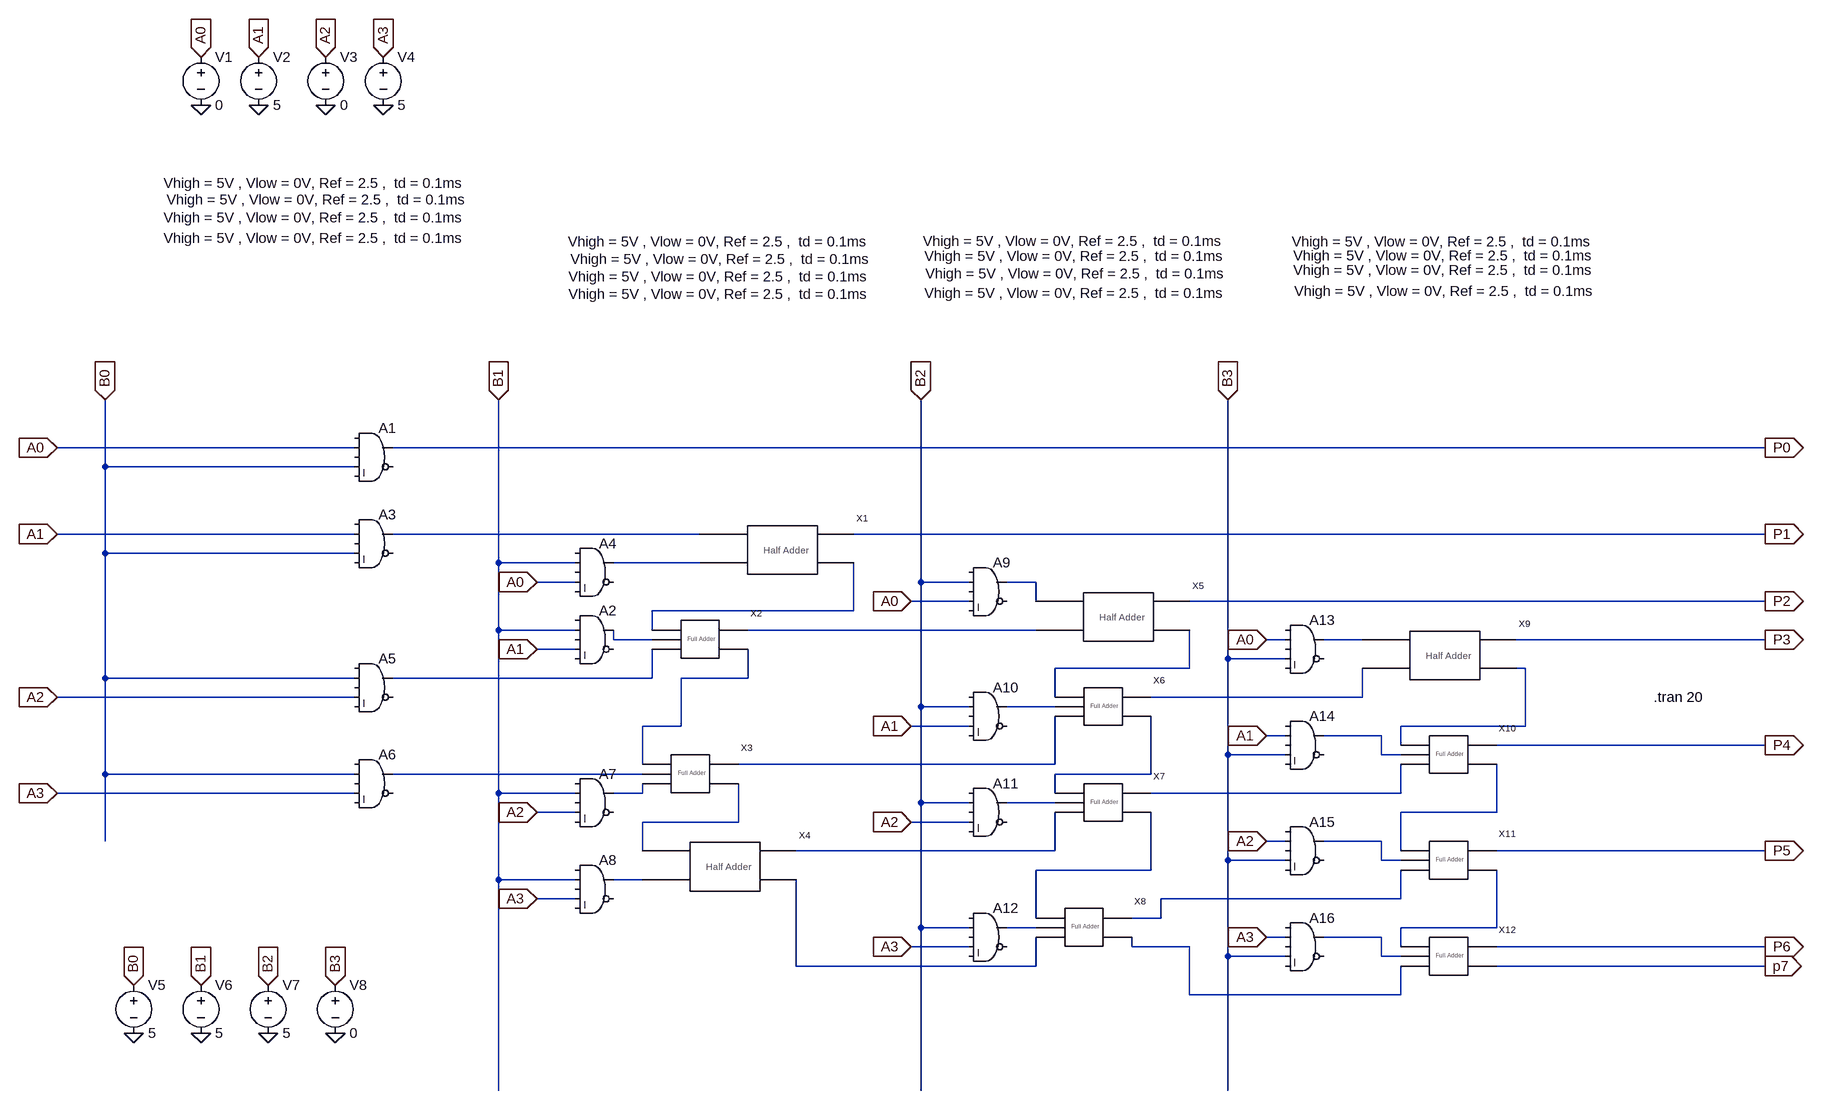
[diagram p0: schematic 4_multiplier.asc]
4_multiplier.asc, the LTspice schematic file:
Version 4
SHEET 1 3064 760
WIRE 224 -736 -272 -736
WIRE 2976 -736 288 -736
WIRE -192 -704 -192 -816
WIRE 224 -704 -192 -704
WIRE 224 -592 -272 -592
WIRE 800 -592 288 -592
WIRE 2976 -592 1056 -592
WIRE -192 -560 -192 -704
WIRE 224 -560 -192 -560
WIRE 464 -544 464 -816
WIRE 592 -544 464 -544
WIRE 800 -544 656 -544
WIRE 592 -512 528 -512
WIRE 1168 -512 1168 -816
WIRE 1248 -512 1168 -512
WIRE 1360 -512 1312 -512
WIRE 1248 -480 1152 -480
WIRE 1360 -480 1360 -512
WIRE 2976 -480 1616 -480
WIRE 1056 -464 1056 -544
WIRE 1056 -464 720 -464
WIRE 464 -432 464 -544
WIRE 592 -432 464 -432
WIRE 720 -432 720 -464
WIRE 1360 -432 880 -432
WIRE 656 -416 656 -432
WIRE 720 -416 656 -416
WIRE 1776 -416 1744 -416
WIRE 1904 -416 1840 -416
WIRE 2976 -416 2160 -416
WIRE 592 -400 528 -400
WIRE 1680 -384 1680 -816
WIRE 1776 -384 1680 -384
WIRE 1616 -368 1616 -432
WIRE 1616 -368 1392 -368
WIRE 2176 -368 2160 -368
WIRE -192 -352 -192 -560
WIRE 224 -352 -192 -352
WIRE 720 -352 720 -400
WIRE 720 -352 288 -352
WIRE 880 -352 880 -400
WIRE 880 -352 768 -352
WIRE 224 -320 -272 -320
WIRE 1392 -320 1392 -368
WIRE 1904 -320 1904 -368
WIRE 1904 -320 1552 -320
WIRE 1168 -304 1168 -512
WIRE 1248 -304 1168 -304
WIRE 1392 -304 1312 -304
WIRE 768 -272 768 -352
WIRE 768 -272 704 -272
WIRE 1248 -272 1152 -272
WIRE 2176 -272 2176 -368
WIRE 2176 -272 1968 -272
WIRE 1776 -256 1744 -256
WIRE 1936 -256 1840 -256
WIRE 1968 -240 1968 -272
WIRE 2976 -240 2128 -240
WIRE 1680 -224 1680 -384
WIRE 1776 -224 1680 -224
WIRE 1936 -224 1936 -256
WIRE 1968 -224 1936 -224
WIRE 704 -208 704 -272
WIRE 1392 -208 1392 -288
WIRE 1392 -208 864 -208
WIRE -192 -192 -192 -352
WIRE 224 -192 -192 -192
WIRE 704 -192 288 -192
WIRE 1552 -192 1552 -288
WIRE 1552 -192 1392 -192
WIRE 224 -160 -272 -160
WIRE 464 -160 464 -432
WIRE 592 -160 464 -160
WIRE 704 -160 704 -176
WIRE 704 -160 656 -160
WIRE 1392 -160 1392 -192
WIRE 1968 -160 1968 -208
WIRE 1968 -160 1552 -160
WIRE 1168 -144 1168 -304
WIRE 1248 -144 1168 -144
WIRE 1392 -144 1312 -144
WIRE 592 -128 528 -128
WIRE 2128 -128 2128 -208
WIRE 2128 -128 1968 -128
WIRE 864 -112 864 -176
WIRE 864 -112 704 -112
WIRE 1248 -112 1152 -112
WIRE -192 -80 -192 -192
WIRE 1776 -80 1744 -80
WIRE 1936 -80 1840 -80
WIRE 704 -64 704 -112
WIRE 1392 -64 1392 -128
WIRE 1392 -64 960 -64
WIRE 1968 -64 1968 -128
WIRE 2976 -64 2128 -64
WIRE 1680 -48 1680 -224
WIRE 1776 -48 1680 -48
WIRE 1936 -48 1936 -80
WIRE 1968 -48 1936 -48
WIRE 1552 -32 1552 -128
WIRE 1552 -32 1360 -32
WIRE 464 -16 464 -160
WIRE 592 -16 464 -16
WIRE 704 -16 656 -16
WIRE 592 16 528 16
WIRE 1968 16 1968 -32
WIRE 1968 16 1568 16
WIRE 1360 48 1360 -32
WIRE 1568 48 1568 16
WIRE 1568 48 1520 48
WIRE 1168 64 1168 -144
WIRE 1248 64 1168 64
WIRE 1360 64 1312 64
WIRE 2128 64 2128 -32
WIRE 2128 64 1968 64
WIRE 1776 80 1744 80
WIRE 1936 80 1840 80
WIRE 1248 96 1152 96
WIRE 1520 96 1520 80
WIRE 1616 96 1520 96
WIRE 1968 96 1968 64
WIRE 2976 96 2128 96
WIRE 1680 112 1680 -48
WIRE 1776 112 1680 112
WIRE 1936 112 1936 80
WIRE 1968 112 1936 112
WIRE 960 128 960 -16
WIRE 1360 128 1360 80
WIRE 1360 128 960 128
WIRE 2976 128 2128 128
WIRE 1616 176 1616 96
WIRE 1968 176 1968 128
WIRE 1968 176 1616 176
WIRE 464 336 464 -16
WIRE 1168 336 1168 64
WIRE 1680 336 1680 112
FLAG -272 -736 A0
IOPIN -272 -736 In
FLAG -272 -592 A1
IOPIN -272 -592 In
FLAG 1152 -480 A0
IOPIN 1152 -480 In
FLAG -272 -160 A3
IOPIN -272 -160 In
FLAG 528 -512 A0
IOPIN 528 -512 In
FLAG 528 -400 A1
IOPIN 528 -400 In
FLAG -272 -320 A2
IOPIN -272 -320 In
FLAG 528 -128 A2
IOPIN 528 -128 In
FLAG 528 16 A3
IOPIN 528 16 In
FLAG 1152 -272 A1
IOPIN 1152 -272 In
FLAG 1152 -112 A2
IOPIN 1152 -112 In
FLAG 1152 96 A3
IOPIN 1152 96 In
FLAG 1744 -416 A0
IOPIN 1744 -416 In
FLAG 1744 -256 A1
IOPIN 1744 -256 In
FLAG 1744 -80 A2
IOPIN 1744 -80 In
FLAG 1744 80 A3
IOPIN 1744 80 In
FLAG -192 -816 B0
IOPIN -192 -816 In
FLAG 464 -816 B1
IOPIN 464 -816 In
FLAG 1168 -816 B2
IOPIN 1168 -816 In
FLAG 2976 -736 P0
IOPIN 2976 -736 Out
FLAG 2976 -592 P1
IOPIN 2976 -592 Out
FLAG 2976 -480 P2
IOPIN 2976 -480 Out
FLAG 2976 -416 P3
IOPIN 2976 -416 Out
FLAG 2976 -240 P4
IOPIN 2976 -240 Out
FLAG 2976 -64 P5
IOPIN 2976 -64 Out
FLAG 2976 96 P6
IOPIN 2976 96 Out
FLAG 1680 -816 B3
IOPIN 1680 -816 In
FLAG -32 -1312 0
FLAG 64 -1312 0
FLAG 176 -1312 0
FLAG 272 -1312 0
FLAG -32 -1392 A0
IOPIN -32 -1392 In
FLAG 64 -1392 A1
IOPIN 64 -1392 In
FLAG 176 -1392 A2
IOPIN 176 -1392 In
FLAG 272 -1392 A3
IOPIN 272 -1392 In
FLAG -144 240 0
FLAG -32 240 0
FLAG 80 240 0
FLAG 192 240 0
FLAG -144 160 B0
IOPIN -144 160 In
FLAG -32 160 B1
IOPIN -32 160 In
FLAG 80 160 B2
IOPIN 80 160 In
FLAG 192 160 B3
IOPIN 192 160 In
FLAG 2976 128 p7
IOPIN 2976 128 Out
SYMBOL Digital\\and 256 -784 R0
WINDOW 3 -350 -335 Left 2
SYMATTR InstName A1
SYMATTR Value Vhigh = 5V , Vlow = 0V, Ref = 2.5 ,  td = 0.1ms
SYMBOL Digital\\and 624 -480 R0
WINDOW 3 -40 -570 Left 2
SYMATTR InstName A2
SYMATTR Value Vhigh = 5V , Vlow = 0V, Ref = 2.5 ,  td = 0.1ms
SYMBOL Digital\\and 256 -640 R0
WINDOW 3 -350 -445 Left 2
SYMATTR InstName A3
SYMATTR Value Vhigh = 5V , Vlow = 0V, Ref = 2.5 ,  td = 0.1ms
SYMBOL Digital\\and 624 -592 R0
WINDOW 3 -44 -487 Left 2
SYMATTR InstName A4
SYMATTR Value Vhigh = 5V , Vlow = 0V, Ref = 2.5 ,  td = 0.1ms
SYMBOL half_adder 944 -560 R0
SYMATTR InstName X1
SYMBOL full_adder 800 -416 R0
SYMATTR InstName X2
SYMBOL Digital\\and 256 -400 R0
WINDOW 3 -345 -749 Left 2
SYMATTR InstName A5
SYMATTR Value Vhigh = 5V , Vlow = 0V, Ref = 2.5 ,  td = 0.1ms
SYMBOL Digital\\and 256 -240 R0
WINDOW 3 -350 -937 Left 2
SYMATTR InstName A6
SYMATTR Value Vhigh = 5V , Vlow = 0V, Ref = 2.5 ,  td = 0.1ms
SYMBOL full_adder 784 -192 R0
SYMATTR InstName X3
SYMBOL Digital\\and 624 -208 R0
WINDOW 3 -43 -813 Left 2
SYMATTR InstName A7
SYMATTR Value Vhigh = 5V , Vlow = 0V, Ref = 2.5 ,  td = 0.1ms
SYMBOL Digital\\and 624 -64 R0
WINDOW 3 -43 -928 Left 2
SYMATTR InstName A8
SYMATTR Value Vhigh = 5V , Vlow = 0V, Ref = 2.5 ,  td = 0.1ms
SYMBOL half_adder 848 -32 R0
SYMATTR InstName X4
SYMBOL Digital\\and 1280 -560 R0
WINDOW 3 -106 -433 Left 2
SYMATTR InstName A9
SYMATTR Value Vhigh = 5V , Vlow = 0V, Ref = 2.5 ,  td = 0.1ms
SYMBOL half_adder 1504 -448 R0
SYMATTR InstName X5
SYMBOL Digital\\and 1280 -352 R0
WINDOW 3 -104 -674 Left 2
SYMATTR InstName A10
SYMATTR Value Vhigh = 5V , Vlow = 0V, Ref = 2.5 ,  td = 0.1ms
SYMBOL full_adder 1472 -304 R0
SYMATTR InstName X6
SYMBOL Digital\\and 1280 -192 R0
WINDOW 3 -106 -863 Left 2
SYMATTR InstName A11
SYMATTR Value Vhigh = 5V , Vlow = 0V, Ref = 2.5 ,  td = 0.1ms
SYMBOL full_adder 1472 -144 R0
SYMATTR InstName X7
SYMBOL Digital\\and 1280 16 R0
WINDOW 3 -108 -1096 Left 2
SYMATTR InstName A12
SYMATTR Value Vhigh = 5V , Vlow = 0V, Ref = 2.5 ,  td = 0.1ms
SYMBOL Digital\\and 1808 -464 R0
WINDOW 3 -17 -533 Left 2
SYMATTR InstName A13
SYMATTR Value Vhigh = 5V , Vlow = 0V, Ref = 2.5 ,  td = 0.1ms
SYMBOL half_adder 2048 -384 R0
SYMATTR InstName X9
SYMBOL Digital\\and 1808 -304 R0
WINDOW 3 -19 -728 Left 2
SYMATTR InstName A14
SYMATTR Value Vhigh = 5V , Vlow = 0V, Ref = 2.5 ,  td = 0.1ms
SYMBOL full_adder 2048 -224 R0
SYMATTR InstName X10
SYMBOL Digital\\and 1808 -128 R0
WINDOW 3 -19 -928 Left 2
SYMATTR InstName A15
SYMATTR Value Vhigh = 5V , Vlow = 0V, Ref = 2.5 ,  td = 0.1ms
SYMBOL full_adder 2048 -48 R0
SYMATTR InstName X11
SYMBOL Digital\\and 1808 32 R0
WINDOW 3 -21 -1111 Left 2
SYMATTR InstName A16
SYMATTR Value Vhigh = 5V , Vlow = 0V, Ref = 2.5 ,  td = 0.1ms
SYMBOL full_adder 2048 112 R0
SYMATTR InstName X12
SYMBOL full_adder 1440 64 R0
SYMATTR InstName X8
SYMBOL voltage -32 -1408 R0
WINDOW 123 0 0 Left 0
WINDOW 39 0 0 Left 0
SYMATTR InstName V1
SYMATTR Value 0
SYMBOL voltage 64 -1408 R0
WINDOW 123 0 0 Left 0
WINDOW 39 0 0 Left 0
SYMATTR InstName V2
SYMATTR Value 5
SYMBOL voltage 176 -1408 R0
WINDOW 123 0 0 Left 0
WINDOW 39 0 0 Left 0
SYMATTR InstName V3
SYMATTR Value 0
SYMBOL voltage 272 -1408 R0
WINDOW 123 0 0 Left 0
WINDOW 39 0 0 Left 0
SYMATTR InstName V4
SYMATTR Value 5
SYMBOL voltage -144 144 R0
WINDOW 123 0 0 Left 0
WINDOW 39 0 0 Left 0
SYMATTR InstName V5
SYMATTR Value 5
SYMBOL voltage -32 144 R0
WINDOW 123 0 0 Left 0
WINDOW 39 0 0 Left 0
SYMATTR InstName V6
SYMATTR Value 5
SYMBOL voltage 80 144 R0
WINDOW 123 0 0 Left 0
WINDOW 39 0 0 Left 0
SYMATTR InstName V7
SYMATTR Value 5
SYMBOL voltage 192 144 R0
WINDOW 123 0 0 Left 0
WINDOW 39 0 0 Left 0
SYMATTR InstName V8
SYMATTR Value 0
TEXT 2768 -320 Left 2 !.tran 20

The netlist it stands for:
* 4_multiplier.asc
A1 0 A0 0 B0 0 0 P0 0 AND Vhigh = 5V , Vlow = 0V, Ref = 2.5 ,  td = 0.1ms
A2 0 B1 0 A1 0 0 N006 0 AND Vhigh = 5V , Vlow = 0V, Ref = 2.5 ,  td = 0.1ms
A3 0 A1 0 B0 0 0 N001 0 AND Vhigh = 5V , Vlow = 0V, Ref = 2.5 ,  td = 0.1ms
A4 0 B1 0 A0 0 0 N002 0 AND Vhigh = 5V , Vlow = 0V, Ref = 2.5 ,  td = 0.1ms
XX1 N001 N002 P1 N004 half_adder  ; pins A B Sum carry
XX2 N004 N006 N010 N011 N005 full_adder  ; pins A B Cin Cout Sum
A5 0 B0 0 A2 0 0 N010 0 AND Vhigh = 5V , Vlow = 0V, Ref = 2.5 ,  td = 0.1ms
A6 0 B0 0 A3 0 0 N016 0 AND Vhigh = 5V , Vlow = 0V, Ref = 2.5 ,  td = 0.1ms
XX3 N011 N016 N018 N022 N015 full_adder  ; pins A B Cin Cout Sum
A7 0 B1 0 A2 0 0 N018 0 AND Vhigh = 5V , Vlow = 0V, Ref = 2.5 ,  td = 0.1ms
A8 0 B1 0 A3 0 0 N026 0 AND Vhigh = 5V , Vlow = 0V, Ref = 2.5 ,  td = 0.1ms
XX4 N022 N026 N024 N032 half_adder  ; pins A B Sum carry
A9 0 B2 0 A0 0 0 N003 0 AND Vhigh = 5V , Vlow = 0V, Ref = 2.5 ,  td = 0.1ms
XX5 N003 N005 P2 N008 half_adder  ; pins A B Sum carry
A10 0 B2 0 A1 0 0 N013 0 AND Vhigh = 5V , Vlow = 0V, Ref = 2.5 ,  td = 0.1ms
XX6 N008 N013 N015 N017 N012 full_adder  ; pins A B Cin Cout Sum
A11 0 B2 0 A2 0 0 N020 0 AND Vhigh = 5V , Vlow = 0V, Ref = 2.5 ,  td = 0.1ms
XX7 N017 N020 N024 N025 N019 full_adder  ; pins A B Cin Cout Sum
A12 0 B2 0 A3 0 0 N028 0 AND Vhigh = 5V , Vlow = 0V, Ref = 2.5 ,  td = 0.1ms
A13 0 A0 0 B3 0 0 N007 0 AND Vhigh = 5V , Vlow = 0V, Ref = 2.5 ,  td = 0.1ms
XX9 N007 N012 P3 N009 half_adder  ; pins A B Sum carry
A14 0 A1 0 B3 0 0 N014 0 AND Vhigh = 5V , Vlow = 0V, Ref = 2.5 ,  td = 0.1ms
XX10 N009 N014 N019 N021 P4 full_adder  ; pins A B Cin Cout Sum
A15 0 A2 0 B3 0 0 N023 0 AND Vhigh = 5V , Vlow = 0V, Ref = 2.5 ,  td = 0.1ms
XX11 N021 N023 N027 N029 P5 full_adder  ; pins A B Cin Cout Sum
A16 0 A3 0 B3 0 0 N030 0 AND Vhigh = 5V , Vlow = 0V, Ref = 2.5 ,  td = 0.1ms
XX12 N029 N030 N031 p7 P6 full_adder  ; pins A B Cin Cout Sum
XX8 N025 N028 N032 N031 N027 full_adder  ; pins A B Cin Cout Sum
V1 A0 0 0
V2 A1 0 5
V3 A2 0 0
V4 A3 0 5
V5 B0 0 5
V6 B1 0 5
V7 B2 0 5
V8 B3 0 0
.tran 20
.backanno
.end